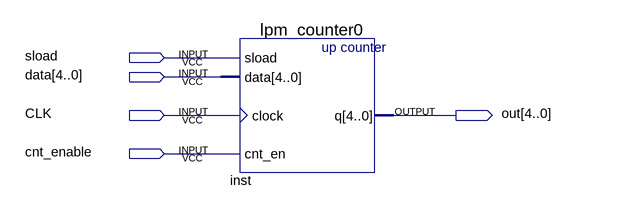
[diagram p0: schematic sheet]
// Quartus schematic PCCount.bdf as structural Verilog: 1 symbols, 5 pins
module PCCount (
  input  sload,
  input  [4:0] data,
  input  CLK,
  input  cnt_enable,
  output [4:0] out
);

  lpm_counter0 inst (.sload(sload), .data(data), .clock(CLK), .cnt_en(cnt_enable), .q(out));
endmodule
